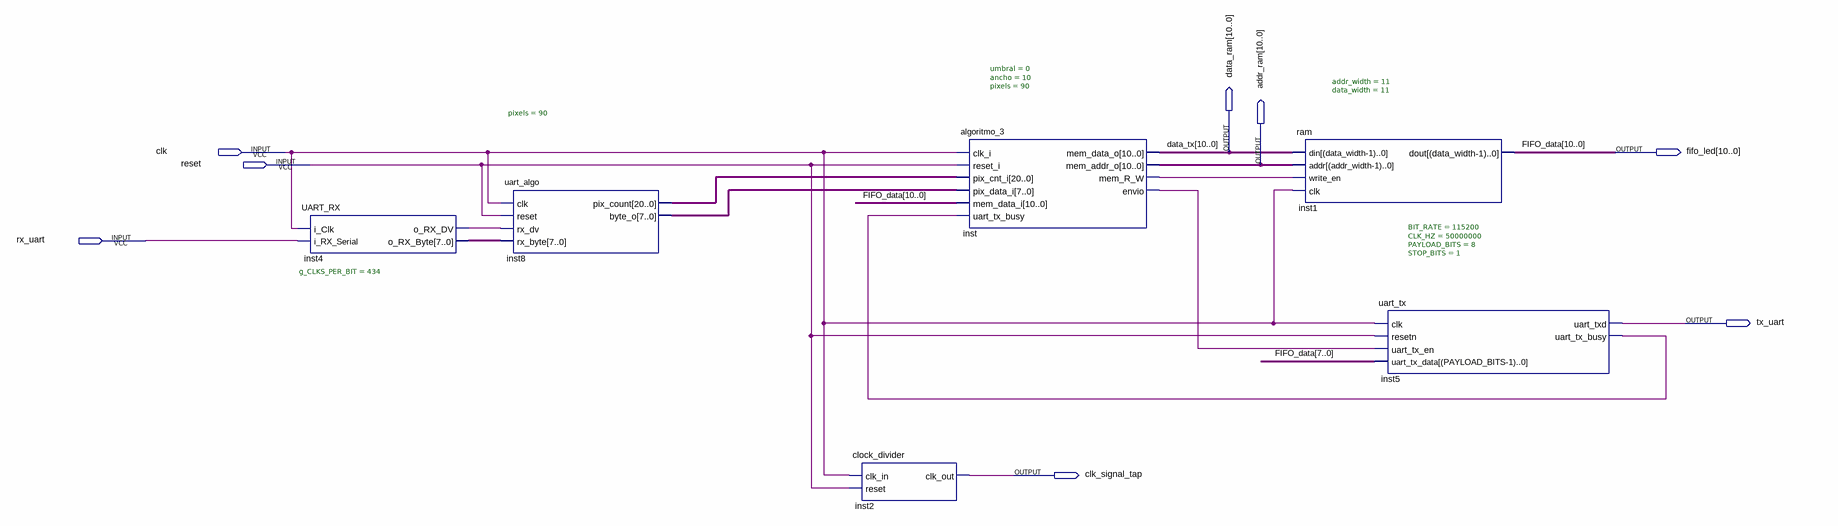
[diagram p0: schematic sheet]
// Quartus schematic top_4.bdf as structural Verilog: 6 symbols, 8 pins
module top_4 (
  input  clk,
  input  reset,
  input  rx_uart,
  output [10:0] data_ram,
  output [10:0] fifo_led,
  output [10:0] addr_ram,
  output tx_uart,
  output clk_signal_tap
);

  wire inst4_o_rx_dv, inst5_uart_tx_busy, inst_envio, inst_mem_r_w;
  wire [7:0] inst4_o_rx_byte, inst8_byte_o;
  wire [20:0] inst8_pix_count;

  UART_RX #(.g_CLKS_PER_BIT(434)) inst4 (
    .i_Clk(clk), .i_RX_Serial(rx_uart), .o_RX_DV(inst4_o_rx_dv), .o_RX_Byte(inst4_o_rx_byte));
  uart_algo #(.pixels(90)) inst8 (
    .clk(clk), .reset(reset), .rx_dv(inst4_o_rx_dv), .rx_byte(inst4_o_rx_byte), .pix_count(inst8_pix_count),
    .byte_o(inst8_byte_o));
  clock_divider inst2 (.clk_in(clk), .reset(reset), .clk_out(clk_signal_tap));
  algoritmo_3 #(.umbral(0), .ancho(10), .pixels(90)) inst (
    .clk_i(clk), .reset_i(reset), .pix_cnt_i(inst8_pix_count), .pix_data_i(inst8_byte_o),
    .mem_data_i(fifo_led), .uart_tx_busy(inst5_uart_tx_busy), .mem_data_o(data_ram), .mem_addr_o(addr_ram),
    .mem_R_W(inst_mem_r_w), .envio(inst_envio));
  ram #(.addr_width(11), .data_width(11)) inst1 (
    .din(data_ram), .addr(addr_ram), .write_en(inst_mem_r_w), .clk(clk), .dout(fifo_led));
  uart_tx #(.BIT_RATE(115200), .CLK_HZ(50000000), .PAYLOAD_BITS(8), .STOP_BITS(1)) inst5 (
    .clk(clk), .resetn(reset), .uart_tx_en(inst_envio), .uart_tx_data(fifo_led[7:0]), .uart_txd(tx_uart),
    .uart_tx_busy(inst5_uart_tx_busy));

  // Other names for the same wires on the sheet: data_tx[10:0] = data_ram; FIFO_data[10:0] = fifo_led
endmodule
